# EAGLE schematic stepUp (EAGLE 7.6.0)
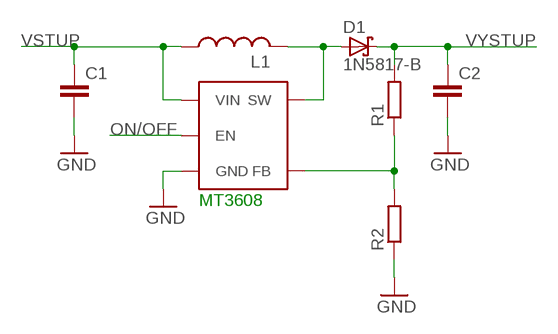
[diagram p0: schematic, sheet 1]

## Parts
C1  C5/3.5  [C5B3.5]
C2  C5/3.5  [C5B3.5]
D1  1N5817-B  [DO41-7.6]
L1  L-US0204/5  [0204/5]
MT3608  MT3605  [MT3608]
R1  R  [R0805]
R2  R  [R0805]

## Nets
GND: C1.2 C2.2 MT3608.P$3(GND) R2.1
N$2: D1.A L1.2 MT3608.P$4(SW)
N$4: MT3608.P$2(FB) R1.1 R2.2
ON/OFF: MT3608.P$1(EN)
VSTUP: C1.1 L1.1 MT3608.P$5(VIN)
VYSTUP: C2.1 D1.C R1.2

## Notes on the sheet
- MT3608

## Library data of the parts
C1 C2 = capacitor-wima:C: CAPACITOR naming: grid - package width
D1 = diode:1N581*: 1.0A SCHOTTKY BARRIER RECTIFIER Source: http://www.diodes.com/datasheets/ds23001.pdf
L1 = resistor:L-US: INDUCTOR, American symbol
MT3608 = diplomka:MT3605
R1 R2 = eagle-ltspice:R: RESISTOR, European symbol; SPICEMODEL: NONE; SPICEPREFIX: R